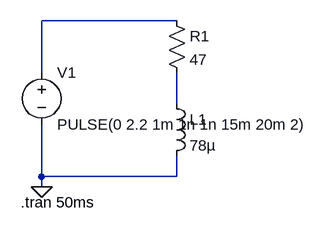
[diagram p0: schematic Lab3_Part2.asc]
Lab3_Part2.asc, the LTspice schematic file:
Version 4
SHEET 1 880 680
WIRE 272 32 64 32
WIRE 64 112 64 32
WIRE 272 160 272 112
WIRE 64 272 64 192
WIRE 272 272 272 240
WIRE 272 272 64 272
WIRE 64 288 64 272
FLAG 64 288 0
SYMBOL ind 256 144 R0
SYMATTR InstName L1
SYMATTR Value 78µ
SYMBOL res 256 16 R0
SYMATTR InstName R1
SYMATTR Value 47
SYMBOL voltage 64 96 R0
WINDOW 123 0 0 Left 0
WINDOW 39 0 0 Left 0
SYMATTR InstName V1
SYMATTR Value PULSE(0 2.2 1m 1n 1n 15m 20m 2)
TEXT 32 312 Left 2 !.tran 50ms

The netlist it stands for:
* Lab3_Part2.asc
L1 N002 0 78µ
R1 N001 N002 47
V1 N001 0 PULSE(0 2.2 1m 1n 1n 15m 20m 2)
.tran 50ms
.backanno
.end